# EAGLE design untitled (EAGLE 9.0.0)
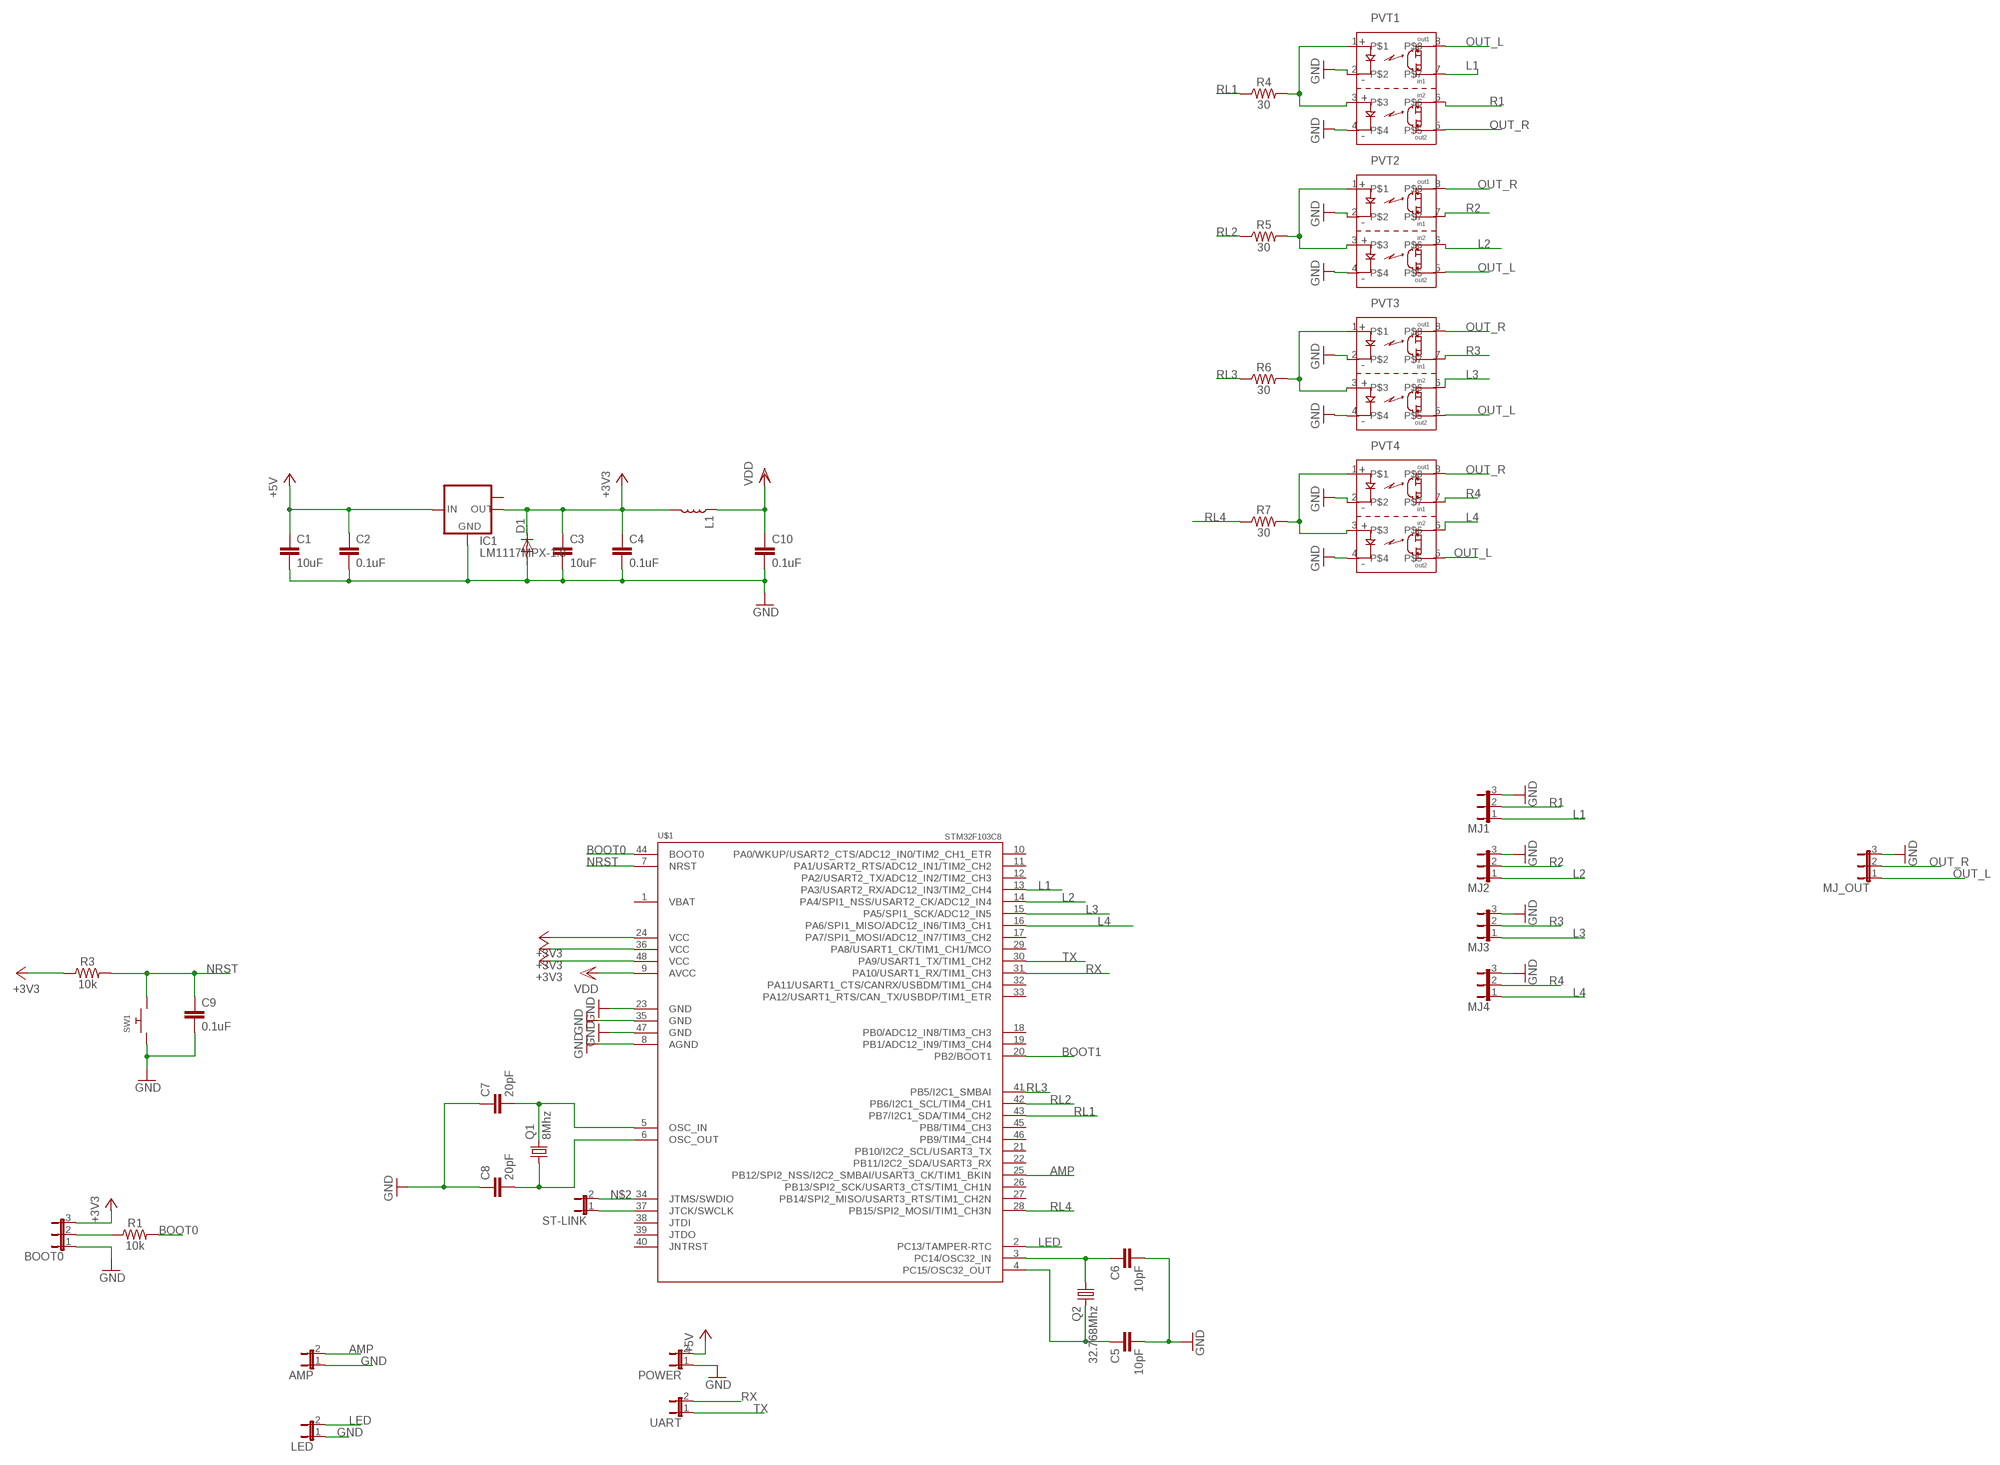
[diagram p0: schematic, sheet 1]

## Parts
AMP  JP1E  [JP1]
BOOT0  JP2E  [JP2]
C1  10uF  10UF-0805-10V-10%  [0805]
C2  0.1uF  10UF-0805-10V-10%  [0805]
C3  10uF  10UF-0805-10V-10%  [0805]
C4  0.1uF  10UF-0805-10V-10%  [0805]
C5  10pF  0.33UF/330NF-0805-50V-10%  [0805]
C6  10pF  0.33UF/330NF-0805-50V-10%  [0805]
C7  20pF  0.33UF/330NF-0805-50V-10%  [0805]
C8  20pF  0.33UF/330NF-0805-50V-10%  [0805]
C9  0.1uF  10UF-0805-10V-10%  [0805]
C10  0.1uF  10UF-0805-10V-10%  [0805]
D1  DIODE-DO214AA  [DO214AA]
IC1  LM1117MPX-1.8  [SOT223]
L1  INDUCTORFB-30OHM  [0603]
LED  JP1E  [JP1]
MJ1  JP2E  [JP2]
MJ2  JP2E  [JP2]
MJ3  JP2E  [JP2]
MJ4  JP2E  [JP2]
MJ_OUT  JP2E  [JP2]
POWER  JP1E  [JP1]
PVT1  PVT322A  [DIP-8]
PVT2  PVT322A  [DIP-8]
PVT3  PVT322A  [DIP-8]
PVT4  PVT322A  [DIP-8]
Q1  8Mhz  CRYSTALHC49S  [HC49/S]
Q2  32.768Mhz  CRYSTALHC49S  [HC49/S]
R1  10k  10KOHM-0603-1/10W-1%  [0603]
R3  10k  10KOHM-0603-1/10W-1%  [0603]
R4  30  10KOHM-0603-1/10W-1%  [0603]
R5  30  10KOHM-0603-1/10W-1%  [0603]
R6  30  10KOHM-0603-1/10W-1%  [0603]
R7  30  10KOHM-0603-1/10W-1%  [0603]
ST-LINK  JP1E  [JP1]
SW1  SWITCH_PUSHBUTTONEVQ-PE  [TACT_PANA-EVQ]
U$1  STM32F103C8  [LQFP48-7X7]
UART  JP1E  [JP1]

## Nets
+3V3: BOOT0.3 C3.1 C4.1 D1.C IC1.2(OUT) L1.2 R3.1 U$1.24(VCC) U$1.36(VCC) U$1.48(VCC)
+5V: C1.1 C2.1 IC1.3(IN) POWER.2
AMP: AMP.2 U$1.25(PB12/SPI2_NSS/I2C2_SMBAI/USART3_CK/TIM1_BKIN)
BOOT0: R1.2 U$1.44(BOOT0)
BOOT1: U$1.20(PB2/BOOT1)
GND: AMP.1 BOOT0.1 C1.2 C2.2 C3.2 C4.2 C5.2 C6.2 C7.1 C8.1 C9.2 C10.2 D1.A IC1.1(GND) LED.1 MJ1.3 MJ2.3 MJ3.3 MJ4.3 MJ_OUT.3 POWER.1 PVT1.2 PVT1.4 PVT2.2 PVT2.4 PVT3.2 PVT3.4 PVT4.2 PVT4.4 SW1.P$1 U$1.8(AGND) U$1.23(GND) U$1.35(GND) U$1.47(GND)
L1: MJ1.1 PVT1.7 U$1.13(PA3/USART2_RX/ADC12_IN3/TIM2_CH4)
L2: MJ2.1 PVT2.6 U$1.14(PA4/SPI1_NSS/USART2_CK/ADC12_IN4)
L3: MJ3.1 PVT3.6 U$1.15(PA5/SPI1_SCK/ADC12_IN5)
L4: MJ4.1 PVT4.6 U$1.16(PA6/SPI1_MISO/ADC12_IN6/TIM3_CH1)
LED: LED.2 U$1.2(PC13/TAMPER-RTC)
N$1: BOOT0.2 R1.1
N$2: ST-LINK.2 U$1.34(JTMS/SWDIO)
N$3: C6.1 Q2.1 U$1.3(PC14/OSC32_IN)
N$4: C8.2 Q1.1 U$1.6(OSC_OUT)
N$5: C7.2 Q1.2 U$1.5(OSC_IN)
N$6: PVT1.1 PVT1.3 R4.2
N$7: C5.1 Q2.2 U$1.4(PC15/OSC32_OUT)
N$8: PVT2.1 PVT2.3 R5.2
N$9: ST-LINK.1 U$1.37(JTCK/SWCLK)
N$11: PVT3.1 PVT3.3 R6.2
N$12: PVT4.1 PVT4.3 R7.2
NRST: C9.1 R3.2 SW1.P$2 U$1.7(NRST)
OUT_L: MJ_OUT.1 PVT1.8 PVT2.5 PVT3.5 PVT4.5
OUT_R: MJ_OUT.2 PVT1.5 PVT2.8 PVT3.8 PVT4.8
R1: MJ1.2 PVT1.6
R2: MJ2.2 PVT2.7
R3: MJ3.2 PVT3.7
R4: MJ4.2 PVT4.7
RL1: R4.1 U$1.43(PB7/I2C1_SDA/TIM4_CH2)
RL2: R5.1 U$1.42(PB6/I2C1_SCL/TIM4_CH1)
RL3: R6.1 U$1.41(PB5/I2C1_SMBAI)
RL4: R7.1 U$1.28(PB15/SPI2_MOSI/TIM1_CH3N)
RX: U$1.31(PA10/USART1_RX/TIM1_CH3) UART.2
TX: U$1.30(PA9/USART1_TX/TIM1_CH2) UART.1
VDD: C10.1 L1.1 U$1.9(AVCC)
Unconnected: IC1.TAB(OUT1) U$1.10(PA0/WKUP/USART2_CTS/ADC12_IN0/TIM2_CH1_ETR) U$1.11(PA1/USART2_RTS/ADC12_IN1/TIM2_CH2) U$1.12(PA2/USART2_TX/ADC12_IN2/TIM2_CH3) U$1.17(PA7/SPI1_MOSI/ADC12_IN7/TIM3_CH2) U$1.18(PB0/ADC12_IN8/TIM3_CH3) U$1.19(PB1/ADC12_IN9/TIM3_CH4) U$1.21(PB10/I2C2_SCL/USART3_TX) U$1.22(PB11/I2C2_SDA/USART3_RX) U$1.26(PB13/SPI2_SCK/USART3_CTS/TIM1_CH1N) U$1.27(PB14/SPI2_MISO/USART3_RTS/TIM1_CH2N) U$1.29(PA8/USART1_CK/TIM1_CH1/MCO) U$1.32(PA11/USART1_CTS/CANRX/USBDM/TIM1_CH4) U$1.33(PA12/USART1_RTS/CAN_TX/USBDP/TIM1_ETR) U$1.38(JTDI) U$1.39(JTDO) U$1.40(JNTRST) U$1.45(PB8/TIM4_CH3) U$1.46(PB9/TIM4_CH4)

## Power pins joined to a net without a drawn wire
VBAT: U$1.1(VBAT)

## Library data of the parts
AMP LED POWER ST-LINK UART = jumper:JP1E: JUMPER
BOOT0 MJ1-MJ4 MJ_OUT = jumper:JP2E: JUMPER
C1 C3 = SparkFun-Capacitors:10UF: 10.0µF ceramic capacitors A capacitor is a passive two-terminal electrical component used to store electrical energy temporarily in an electric field.; PROD_ID: CAP-11330
C2 C4 C9 C10 = SparkFun-Capacitors:10UF: 10.0µF ceramic capacitors A capacitor is a passive two-terminal electrical component used to store electrical energy temporarily in an electric field.; PROD_ID: CAP-11330; VALUE: 10uF
C5-C8 = SparkFun-Capacitors:0.33UF/330NF: 0.33µF/330nF ceramic capacitors A capacitor is a passive two-terminal electrical component used to store electrical energy temporarily in an electric field.; PROD_ID: CAP-08469; VALUE: 0.33µF
D1 = diode:DIODE-: DIODE
IC1 = lm1117:LM1117MPX-*
L1 = SparkFun-Coils:INDUCTOR: Inductors Resist changes in electrical current. Basically a coil of wire. SparkFun Products: SparkFun Load Cell Amplifier - HX711 <https://www.sparkfun.com/products/13879> IOIO-OTG - V2.2 <https://www.sparkfun.com/products/13613>; PROD_ID: NDUC-07859
PVT1-PVT4 = PVT322:PVT322A
Q1 Q2 = crystal:CRYSTAL: CRYSTAL; OC_FARNELL: 1667008; OC_NEWARK: unknown
R1 R3 = SparkFun-Resistors:10KOHM: 10kΩ resistor A resistor is a passive two-terminal electrical component that implements electrical resistance as a circuit element. Resistors act to reduce current flow, and, at the same time, act to lower voltage levels within circuits. - Wikipedia; PROD_ID: RES-00824
R4-R7 = SparkFun-Resistors:10KOHM: 10kΩ resistor A resistor is a passive two-terminal electrical component that implements electrical resistance as a circuit element. Resistors act to reduce current flow, and, at the same time, act to lower voltage levels within circuits. - Wikipedia; PROD_ID: RES-00824; VALUE: 10k
SW1 = adafruit:SWITCH_PUSHBUTTON: Buttons SOFTTOUCHSMD_SJ - Soft touch temporary push button (Super Junk Akihabara) Compatible with SKPMANE010 [Mouser: 688-SKPMAN] C&K_KSS = Digikey: KSS221GLFS
U$1 = stm32:STM32F103C8

## Board
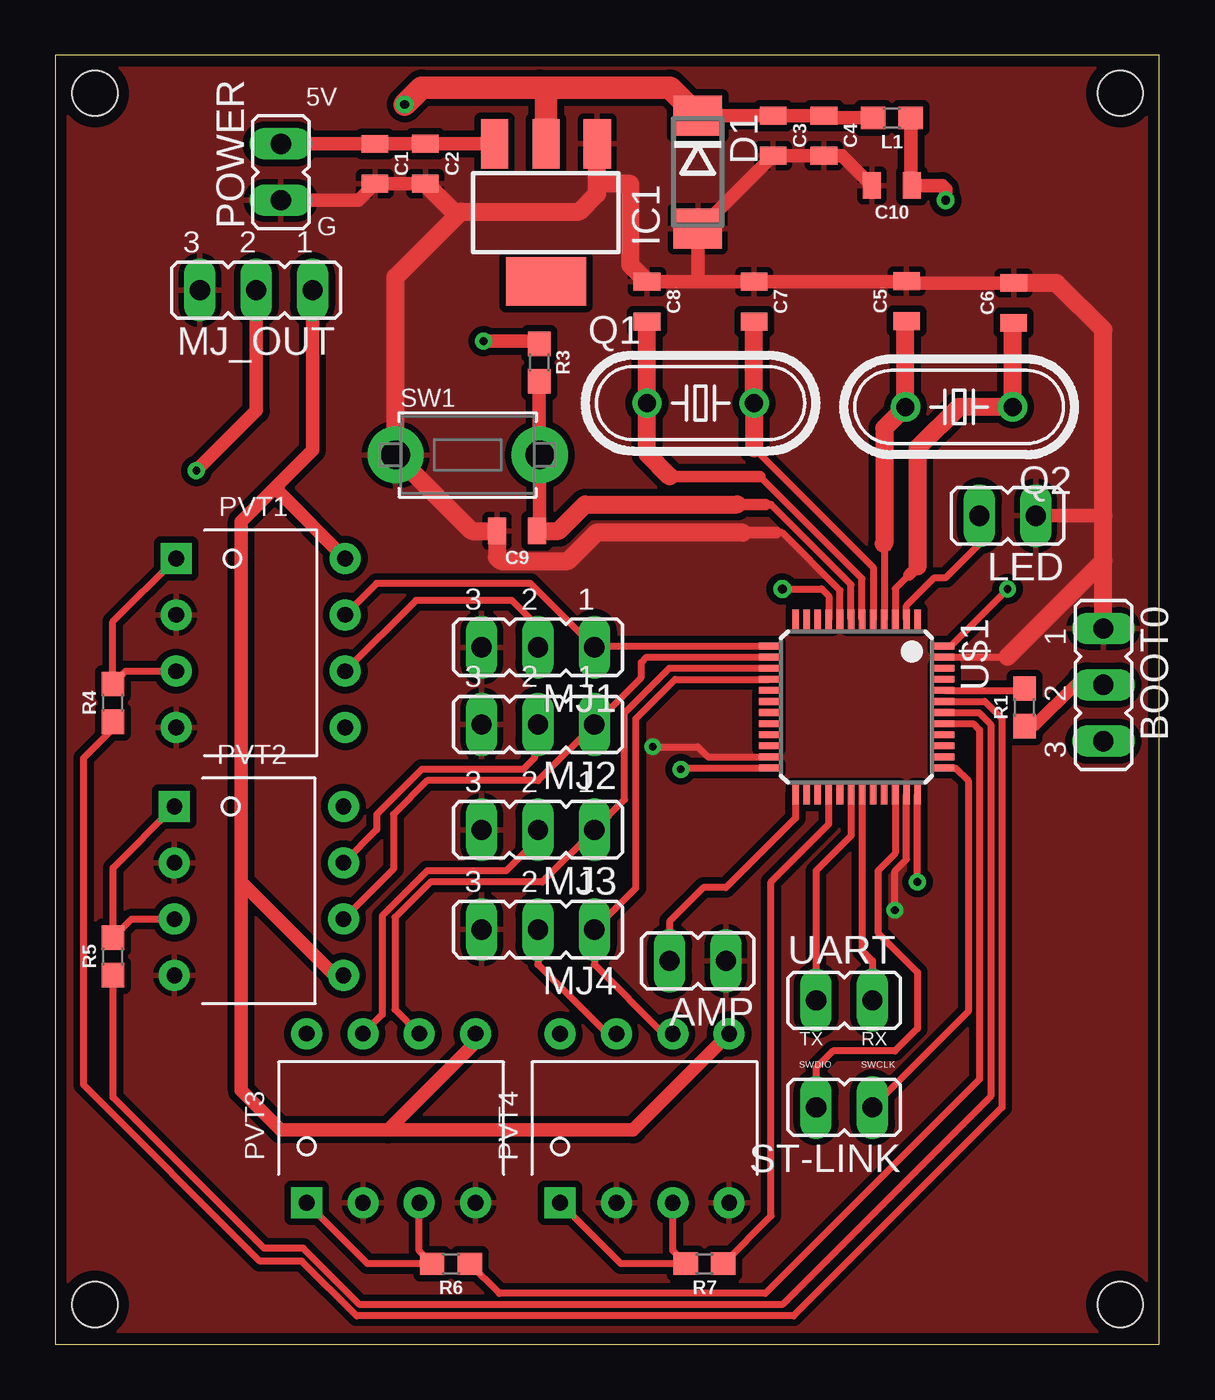
[diagram p1: board, top side]
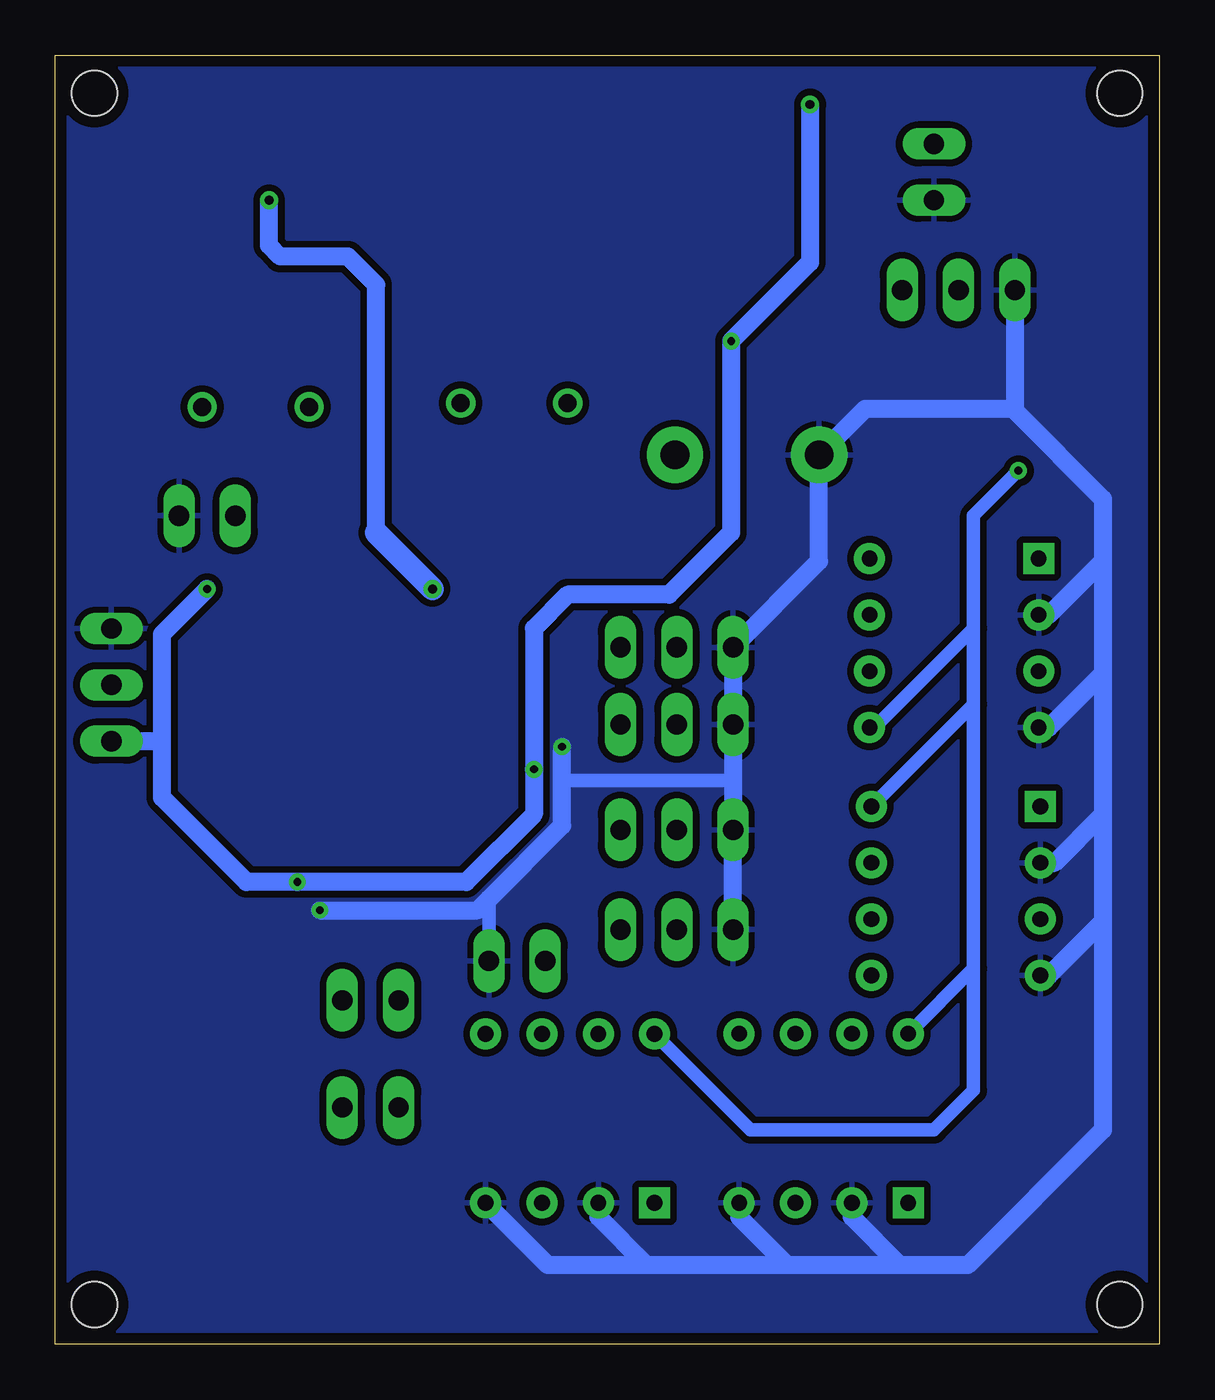
[diagram p2: board, bottom side, seen from below]

Size 49.76 x 58.09 mm. Coordinates in mm from the lower left corner, seen from the top.
Outline: 0,0 49.76,0 49.76,58.09 0,58.09 0,0
Copper layers (1*16): Top 0.035mm / dielectric 1.5mm / Bottom 0.035mm
Design rules "default *": minimum track width 6mil, minimum drill 0.35mm, track to track 6mil, track to pad 6mil, pad to pad 6mil, via to via 6mil, smd to smd 6mil, copper to edge 20mil, drill to drill 6mil, minimum pad ring 10mil, minimum via ring 8mil, stop-mask expansion 4mil, vias tented up to drill 0mil, thermal gap 10mil
Holes 2.03 mm at 1.78,56.39 48.01,56.39 48.01,1.78 1.78,1.78

### Footprints (pad centres in the part's own frame; a part is rotated, then mirrored left to right if it is on the bottom)
JP1 = drill 0.914 long: 1 0,-1.27; 2 0,1.27
JP2 = drill 0.914 long: 1 -2.54,0; 2 0,0; 3 2.54,0
0805 = smd 0.8 x 1.2: 1 -0.9,0; 2 0.9,0
DO214AA = smd 1.8 x 2.2: A 2.55,0; C -2.55,0
SOT223 = smd 1.219 x 2.235: 1 -2.311,-3.099; 2 0,-3.099; 3 2.311,-3.099 | smd 3.6 x 2.2: TAB 0,3.099
0603 = smd 1.1 x 1: 1 -0.85,0; 2 0.85,0
DIP-8 = drill 0.711 pad 1.397 square: 1 -2.54,-5.08 | drill 0.711 pad 1.397: 2 0,-5.08; 3 2.54,-5.08; 4 5.08,-5.08; 5 5.08,2.54; 6 2.54,2.54; 7 0,2.54; 8 -2.54,2.54
HC49/S = drill 0.813: 1 -2.413,0; 2 2.413,0
TACT_PANA-EVQ = drill 1.3 pad 2.54: P$1 -3.25,0; P$2 3.25,0
LQFP48-7X7 = smd 0.9 x 0.3: 1 -3.95,2.75; 2 -3.95,2.25; 3 -3.95,1.75; 4 -3.95,1.25; 5 -3.95,0.75; 6 -3.95,0.25; 7 -3.95,-0.25; 8 -3.95,-0.75; 9 -3.95,-1.25; 10 -3.95,-1.75; 11 -3.95,-2.25; 12 -3.95,-2.75; 25 3.95,-2.75; 26 3.95,-2.25; 27 3.95,-1.75; 28 3.95,-1.25; 29 3.95,-0.75; 30 3.95,-0.25; 31 3.95,0.25; 32 3.95,0.75; 33 3.95,1.25; 34 3.95,1.75; 35 3.95,2.25; 36 3.95,2.75 | smd 0.3 x 0.9: 13 -2.75,-3.95; 14 -2.25,-3.95; 15 -1.75,-3.95; 16 -1.25,-3.95; 17 -0.75,-3.95; 18 -0.25,-3.95; 19 0.25,-3.95; 20 0.75,-3.95; 21 1.25,-3.95; 22 1.75,-3.95; 23 2.25,-3.95; 24 2.75,-3.95; 37 2.75,3.95; 38 2.25,3.95; 39 1.75,3.95; 40 1.25,3.95; 41 0.75,3.95; 42 0.25,3.95; 43 -0.25,3.95; 44 -0.75,3.95; 45 -1.25,3.95; 46 -1.75,3.95; 47 -2.25,3.95; 48 -2.75,3.95

### Placement (x,y rotation side)
AMP  28.96,17.27 90 top
BOOT0  47.24,29.72 270 top
C1  14.4,53.2 270 top
C2  16.68,53.21 270 top
C3  32.36,54.47 270 top
C4  34.64,54.47 270 top
C5  38.37,47.01 90 top
C6  43.2,46.94 90 top
C7  31.5,46.99 270 top
C8  26.67,46.99 270 top
C9  20.81,36.66 180 top
C10  37.71,52.23 180 top
D1  28.96,52.83 270 top
IC1  22.11,51.01 180 top
L1  37.71,55.27 180 top
LED  42.93,37.34 90 top
MJ1  21.75,31.41 180 top
MJ2  21.75,27.93 180 top
MJ3  21.75,23.18 180 top
MJ4  21.75,18.68 180 top
MJ_OUT  9.05,47.51 180 top
POWER  10.16,52.83 0 top
PVT1  10.52,32.87 270 top
PVT2  10.44,21.7 270 top
PVT3  13.86,11.45 0 top
PVT4  25.29,11.44 0 top
Q1  29.08,42.42 0 top
Q2  40.74,42.25 180 top
R1  43.69,28.7 90 top
R3  21.81,44.25 270 top
R4  2.59,28.91 90 top
R5  2.6,17.48 90 top
R6  17.83,3.62 180 top
R7  29.26,3.63 180 top
ST-LINK  35.56,10.67 90 top
SW1  18.58,40.08 0 top
U$1  36.12,28.72 270 top
UART  35.56,15.49 270 top

### Tracks (layer width: path | path; a pad name or v marks a point on that pad's centre or on a via)
+3V3  (via drill 0.35, 0.4)
  Top 0.305: v28.19,25.91 28.25,25.97 U$1.24 | v42.93,34.04 40.36,31.47 U$1.48 | v38.86,20.83 U$1.36
  Top 0.406: C4.1 34.74,55.27 | 21.67,44.96 R3.1
  Top 0.61: C4.1 C3.1 D1.C | 34.74,55.27 L1.2 | v19.3,45.21 21.69,45.21 R3.1
  Top 1.016: v15.75,55.88 16.51,56.64 21.84,56.64 | IC1.2 22.11,56.37 21.84,56.64 | 21.84,56.64 27.7,56.64 D1.C
  Bottom 0.813: v15.75,55.88 15.75,48.77 v19.3,45.21 19.3,36.58 22.1,33.78 26.67,33.78 28.19,32.26 v28.19,25.91 28.19,23.88 31.24,20.83 v38.86,20.83 41.15,20.83 44.96,24.64 44.96,27.18 | v42.93,34.04 44.96,32 44.96,27.18 | BOOT0.3 44.96,27.18
+5V
  Top 0.406: 16.67,54.1 C2.1 16.69,54.1 | IC1.3
  Top 0.61: 16.67,54.1 C1.1 POWER.2 | 16.69,54.1 IC1.3
AMP
  Top 0.305: U$1.25 33.37,23.71 30.23,20.57 29.21,20.57 27.69,19.05 AMP.2
BOOT0
  Top 0.305: U$1.44 43.6,29.47 R1.2
GND  (via drill 0.35)
  Top 0.305: U$1.47 42.91,30.97 42.93,30.99 | U$1.8 35.37,33.98 32.77,36.58 32.51,36.58 | v37.85,19.56 37.85,21.34 38.37,21.86 U$1.35 | v26.92,26.92 28.96,26.92 29.41,26.47 U$1.23
  Top 0.406: 16.67,52.3 C2.2 | C1.2 | 24.45,52.3 24.42,52.32 | C5.2 38.39,47.89 38.45,47.84
  Top 0.508: 32.51,36.58 30.99,36.58
  Top 0.61: 16.67,52.3 C1.2 13.66,51.56 POWER.1 | C10.2 35.46,53.57 C4.2 C3.2 29.06,50.28 D1.A 28.96,47.89 | 28.96,47.89 C7.1 38.39,47.89 | 28.96,47.89 C8.1 | C6.2 38.45,47.84 | LED.1 47.24,37.34
  Top 0.813: C2.2 17.94,51.05 18.29,51.05 | IC1.1 24.42,52.32 24.42,51.86 23.62,51.05 18.29,51.05 | 24.45,52.3 25.91,52.3 25.91,48.65 C8.1 | 18.29,51.05 15.33,48.1 SW1.P$1 18.76,36.66 C9.2 19.91,35.46 20.07,35.31 23.11,35.31 24.38,36.58 30.99,36.58 | 42.93,30.99 47.24,35.31 | C6.2 45.13,47.84 47.24,45.72 47.24,37.34 47.24,35.31 | BOOT0.1 47.24,35.31
  Bottom 0.61: 26.92,25.4 19.21,25.4 | AMP.1 30.23,20.07
  Bottom 0.813: 2.54,35.31 2.54,38.1 6.51,42.07 | 2.54,35.31 2.54,30.23 | 2.54,30.23 2.54,23.88 | 2.54,23.88 2.54,19.05 | 2.54,19.05 2.54,9.65 8.64,3.56 11.68,3.56 | 11.68,3.56 16.76,3.56 | 16.76,3.56 23.11,3.56 | 23.11,3.56 27.57,3.56 PVT4.4 | 6.51,42.07 6.6,42.16 13.25,42.16 SW1.P$1 15.33,35.29 MJ1.3 MJ2.3 19.21,25.4 MJ3.3 MJ4.3 | MJ_OUT.3 6.51,42.07 | PVT1.2 4.97,32.87 2.54,35.31 | PVT1.4 4.97,27.79 2.54,30.23 | PVT2.2 4.72,21.7 2.54,23.88 | PVT2.4 4.97,16.62 2.54,19.05 | PVT3.2 13.86,5.73 11.68,3.56 | PVT3.4 18.94,5.73 16.76,3.56 | PVT4.2 25.29,5.73 23.11,3.56 | v37.85,19.56 30.73,19.56 30.23,20.07 26.92,23.37 26.92,25.4 v26.92,26.92
  pour Top (isolate 0.305): -0.51,58.42 50.29,58.42 50.29,-0.25 -0.51,-0.25
  pour Bottom (isolate 0.305): -1.52,59.18 51.56,59.18 51.56,-1.27 -1.52,-1.27
L1
  Top 0.305: U$1.13 24.35,31.47 MJ1.1 21.41,34.29 14.48,34.29 PVT1.7
L2
  Top 0.305: U$1.14 26.65,30.97 26.42,30.73 26.42,30.05 MJ2.1 21.76,25.4 16.76,25.4 15.24,23.88 15.24,21.42 PVT2.6
L3
  Top 0.305: PVT3.6 15.31,15.08 15.31,19.23 16.9,20.83 21.94,20.83 MJ3.1 25.65,24.54 25.65,28.45 27.67,30.47 U$1.15
L4
  Top 0.305: PVT4.6 27.42,13.98 24.29,17.11 MJ4.1 26.16,20.55 26.16,28.19 27.94,29.97 U$1.16
LED
  Top 0.305: U$1.2 38.37,33.29 39.62,34.54 40.13,34.54 41.66,36.07 LED.2
N$1
  Top 0.305: R1.1 43.78,27.94
  Top 0.508: R1.1 44.11,27.85 45.97,29.72 BOOT0.2
N$2
  Top 0.305: U$1.34 37.87,22.12 37.08,21.34 37.08,18.54 38.86,16.76 38.86,14.22 37.85,13.21 35.05,13.21 34.29,12.45 ST-LINK.2
N$3
  Top 0.305: 38.48,34.67 37.87,34.06 U$1.3
  Top 0.406: 43.15,45.99 C6.1
  Top 0.508: 38.86,35.05 38.48,34.67
  Top 0.813: 43.15,45.99 Q2.1 40.72,42.25 38.86,40.39 38.86,35.05
N$4
  Top 0.305: U$1.6 36.37,34.5 31.75,39.12
  Top 0.508: 31.75,39.12 27.69,39.12
  Top 0.813: C8.2 Q1.1 26.67,40.13 27.69,39.12
N$5
  Top 0.305: 31.5,40.39 36.87,35.02 U$1.5
  Top 0.813: C7.2 Q1.2 31.5,40.39
N$6
  Top 0.305: PVT1.3 3.17,30.33 R4.2 2.59,32.56 PVT1.1
N$7
  Top 0.305: 37.37,36.1 U$1.4
  Top 0.406: 38.33,46.06 C5.1
  Top 0.813: 38.33,46.06 Q2.2 37.37,41.28 37.37,36.1 37.34,36.07
N$8
  Top 0.305: PVT2.3 3.43,19.16 R5.2 2.6,21.47 PVT2.1
N$9
  Top 0.305: U$1.37 40.58,25.97 41.15,25.4 41.15,14.99 ST-LINK.1
N$11
  Top 0.305: PVT3.1 14.07,3.62 R6.2 16.4,4.2 PVT3.3
N$12
  Top 0.305: PVT4.1 25.49,3.63 R7.2 27.83,4.21 PVT4.3
NRST
  Top 0.305: U$1.7 35.87,34.24 32.26,37.85 32,37.85
  Top 0.508: 32,37.85 30.73,37.85
  Top 0.61: R3.2 21.81,40.11 SW1.P$2 21.83,36.78 C9.1
  Top 0.813: C9.1 22.69,36.66 23.88,37.85 30.73,37.85
OUT_L
  Top 0.61: 8.38,20.83 8.38,11.43 10.16,9.65 14.99,9.65 | PVT3.5 18.94,13.61 14.99,9.65 | PVT2.5 12.59,16.62 8.38,20.83 | PVT4.5 26.04,9.65 14.99,9.65 | 10.03,38.73 8.38,37.08 8.38,20.83 | PVT1.8 10.03,38.44 10.03,38.73 | MJ_OUT.1 11.59,40.29 10.03,38.73
OUT_R  (via drill 0.35)
  Top 0.61: v6.35,39.37 9.05,42.07 MJ_OUT.2
  Bottom 0.61: PVT4.8 18.42,9.65 10.16,9.65 8.38,11.43 8.38,16.93 | 8.38,16.93 8.38,28.84 | 8.38,28.84 8.38,32.26 | PVT1.5 12.85,27.79 8.38,32.26 | PVT2.8 8.38,28.84 | PVT3.8 8.38,16.93 | v6.35,39.37 8.38,37.34 8.38,32.26
R1
  Top 0.305: MJ1.2 21.75,32.35 20.57,33.53 16.25,33.53 PVT1.6
R2
  Top 0.305: MJ2.2 21.59,27.77 21.59,26.42 21.08,25.91 16.51,25.91 14.48,23.88 14.48,23.19 PVT2.7
R3
  Top 0.305: MJ3.2 21.75,22.77 20.32,21.34 16.76,21.34 14.73,19.3 14.73,14.86 PVT3.7
R4
  Top 0.305: MJ4.2 21.75,17.11 24.88,13.98 PVT4.7
RL1
  Top 0.305: U$1.43 41.9,28.97 42.67,28.19 42.67,10.67 33.27,1.27 13.58,1.27 11.11,3.74 9.21,3.74 1.27,11.68 1.27,26.42 2.59,27.73 R4.1
RL2
  Top 0.305: U$1.42 41.64,28.47 42.16,27.94 42.16,11.18 32.77,1.78 13.72,1.78 11.18,4.32 9.4,4.32 2.6,11.12 R5.1
RL3
  Top 0.305: U$1.41 41.37,27.97 41.66,27.69 41.66,11.94 32,2.29 20.01,2.29 R6.1
RL4
  Top 0.305: R7.1 32.26,5.78 32.26,20.83 34.87,23.44 U$1.28
RX
  Top 0.305: U$1.31 36.37,17.74 36.83,17.27 UART.2
TX
  Top 0.305: U$1.30 35.87,22.91 34.29,21.34 UART.1
VDD  (via drill 0.4)
  Top 0.305: v32.77,34.04 34.54,34.04 34.87,33.71 U$1.9
  Top 0.406: 38.56,52.28 C10.1
  Top 0.61: L1.1 38.56,52.28 | C10.1 39.98,52.23 40.13,52.07 v40.13,51.56
  Bottom 0.813: 35.31,36.58 35.31,47.75 36.58,49.02 39.62,49.02 40.13,49.53 v40.13,51.56
  Bottom 1.016: v32.77,34.04 35.31,36.58

### Text on the board
tPlace: 5V | G | TX | RX | SWDIO | SWCLK
tValues: 0 | 1
_tplace: 3 | 2 | 1 | 3 | 2 | G | 1 | 3 | 2 | 1 | 2 | 3 | 3 | 2 | G | 3 | 2 | 1